# Altium project RXTX42_ver.0.0.PrjPcb
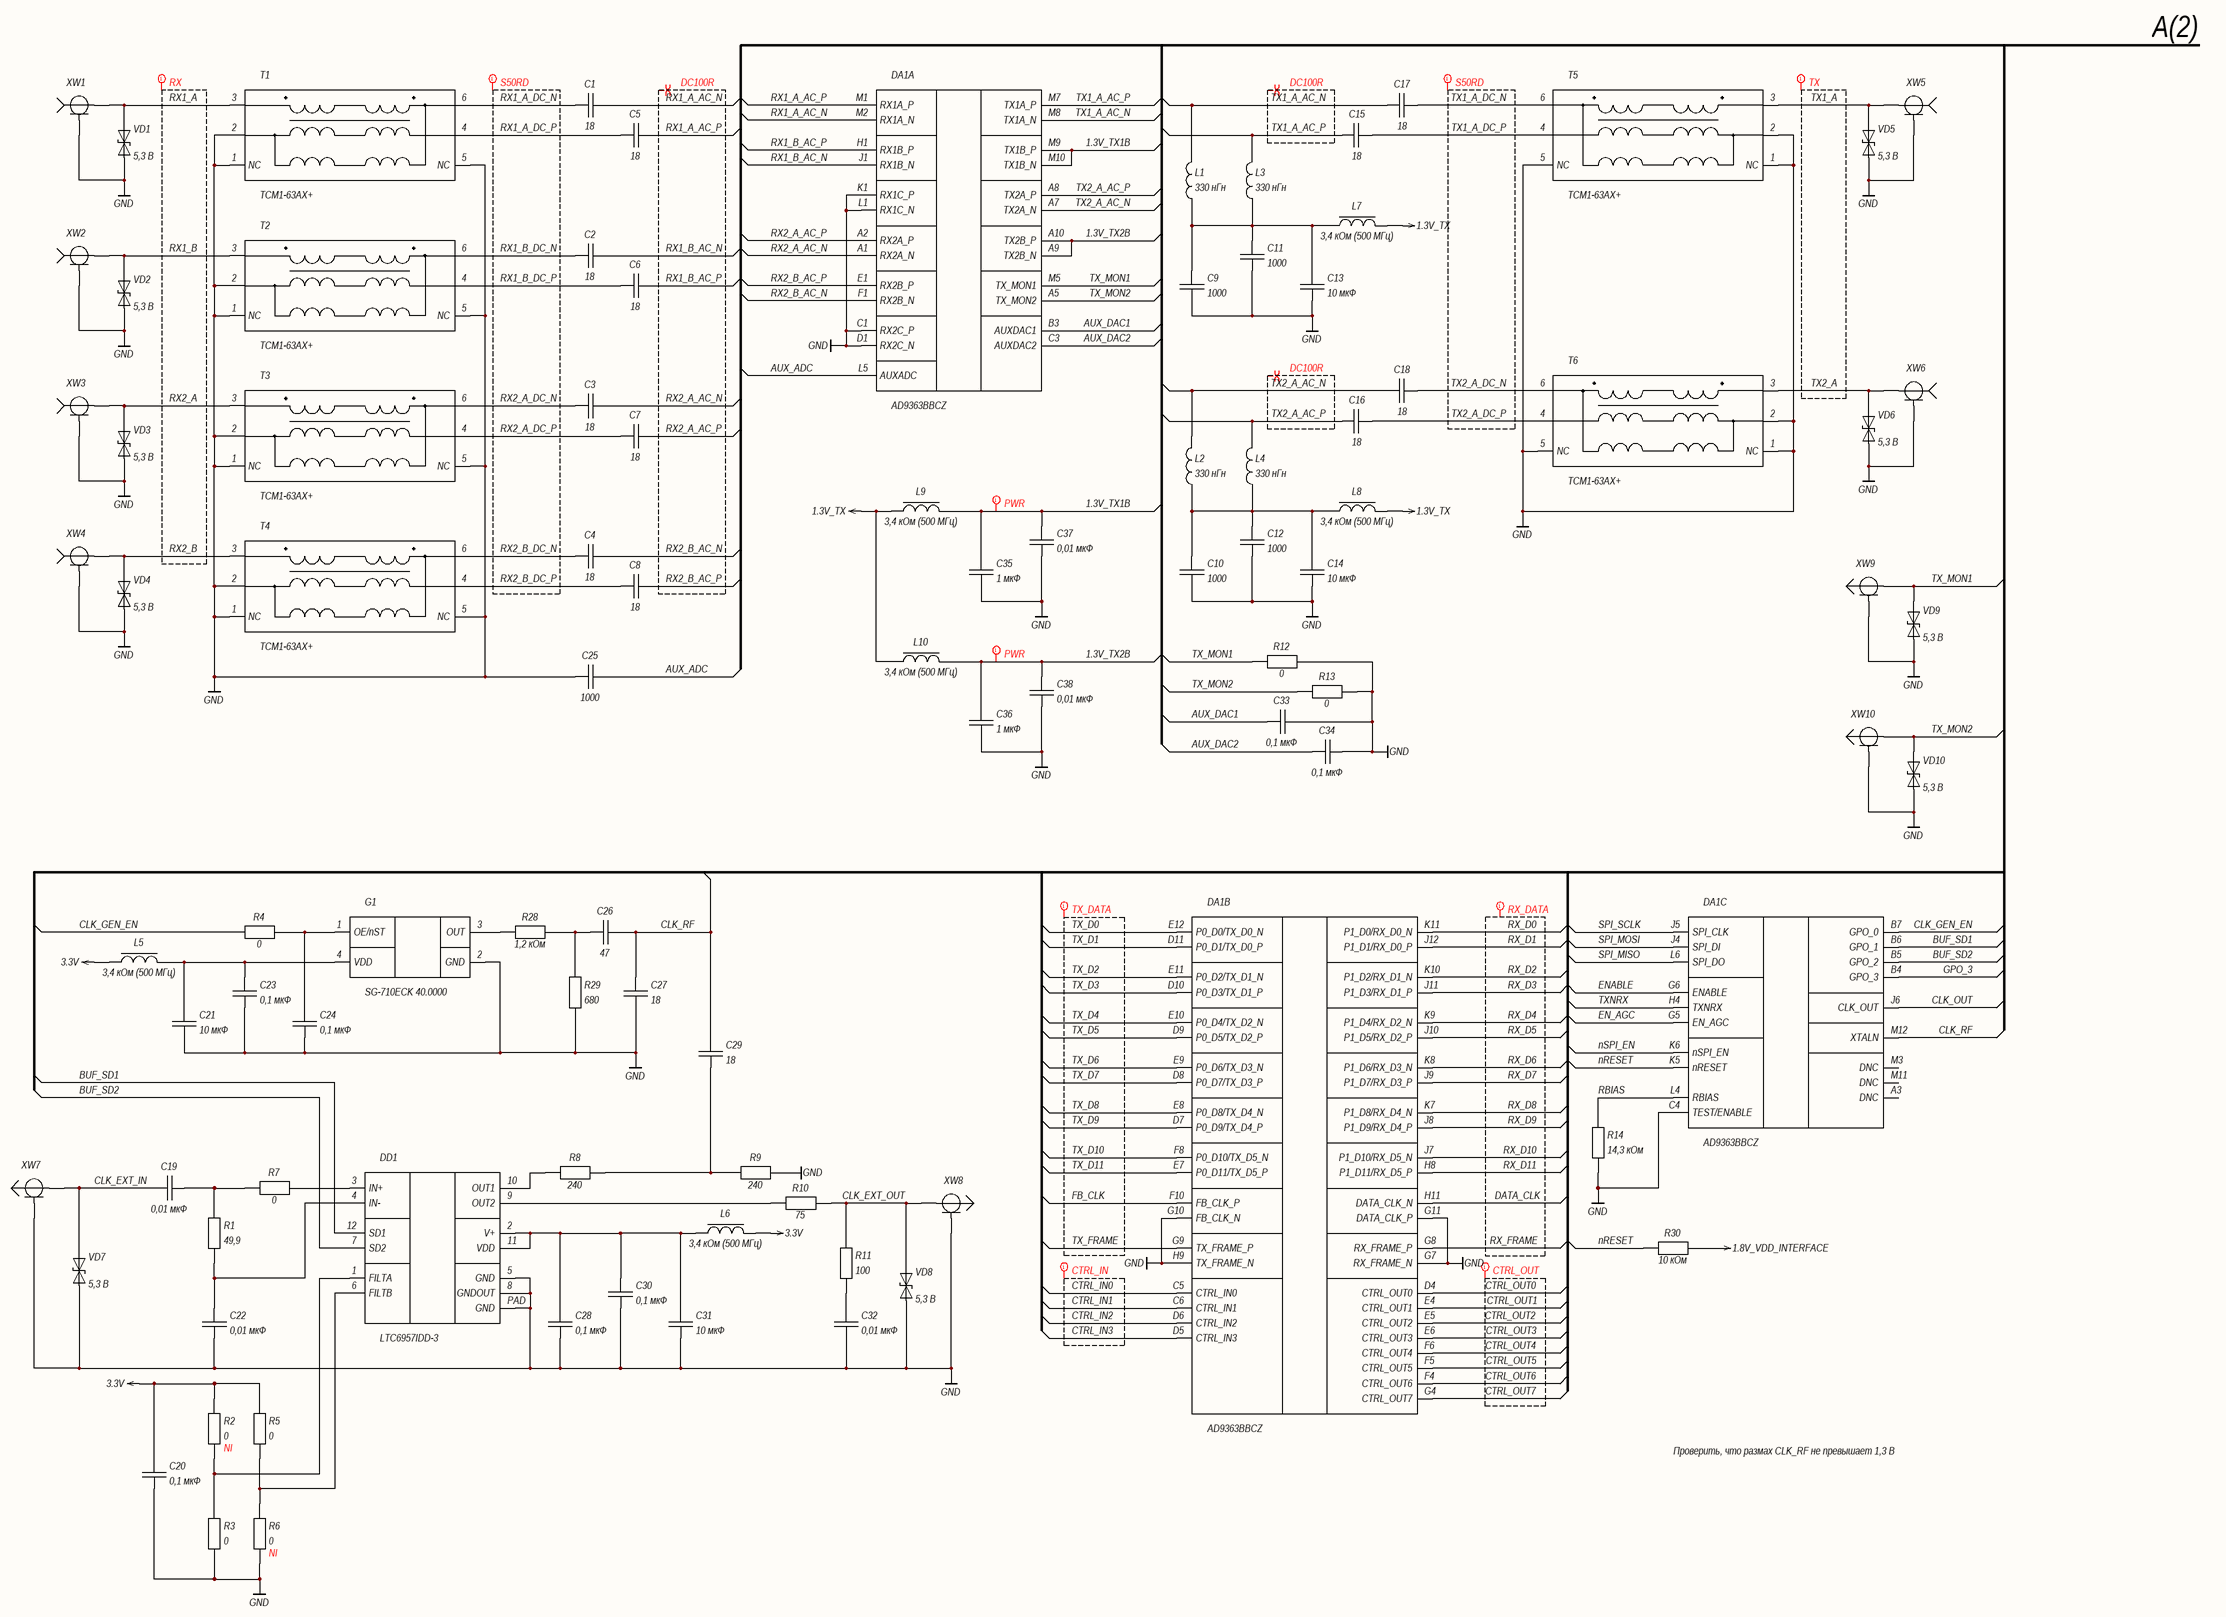
[diagram p0: Э3-1.SchDoc]
2 sheets, 189 parts. Net scope: global (net labels, ports and power ports of the same name join across sheets).
Board file: RXTX42_ver.0.0.PcbDoc
Sheets:
  Э3-1.SchDoc
  Э3-2.SchDoc

## Sheet Э3-1.SchDoc
size 840 x 594 mm; Address1: Address1; Address2: Address2; Address3: Address3; Address4: Address4; DocumentNumber: АБВГ.123456.001 Э3; SheetNumber: 1; SheetTotal: 2; Scale: 1:1; DocumentType: Схема электрическая принципиальная; FirstReferrence: АБВГ.123456.001

### Parts
C1  value 18  [C0201-B-0.3mm-NO]
C2  value 18  [C0201-B-0.3mm-NO]
C3  value 18  [C0201-B-0.3mm-NO]
C4  value 18  [C0201-B-0.3mm-NO]
C5  value 18  [C0201-B-0.3mm-NO]
C6  value 18  [C0201-B-0.3mm-NO]
C7  value 18  [C0201-B-0.3mm-NO]
C8  value 18  [C0201-B-0.3mm-NO]
C9  value 1000  [C0201-B-0.3mm-NO]
C10  value 1000  [C0201-B-0.3mm-NO]
C11  value 1000  [C0201-B-0.3mm-NO]
C12  value 1000  [C0201-B-0.3mm-NO]
C13  value 10 мкФ  [C0603-B-0.8mm-NO]
C14  value 10 мкФ  [C0603-B-0.8mm-NO]
C15  value 18  [C0201-B-0.3mm-NO]
C16  value 18  [C0201-B-0.3mm-NO]
C17  value 18  [C0201-B-0.3mm-NO]
C18  value 18  [C0201-B-0.3mm-NO]
C19  value 0,01 мкФ  [C0201-B-0.3mm-NO]
C20  value 0,1 мкФ  [C0402-B-0.5mm-NO]
C21  value 10 мкФ  [C0603-B-0.8mm-NO]
C22  value 0,01 мкФ  [C0201-B-0.3mm-NO]
C23  value 0,1 мкФ  [C0402-B-0.5mm-NO]
C24  value 0,1 мкФ  [C0402-B-0.5mm-NO]
C25  value 1000  [C0201-B-0.3mm-NO]
C26  value 47  [C0402-B-0.5mm-NO]
C27  value 18  [C0201-B-0.3mm-NO]
C28  value 0,1 мкФ  [C0402-B-0.5mm-NO]
C29  value 18  [C0201-B-0.3mm-NO]
C30  value 0,1 мкФ  [C0402-B-0.5mm-NO]
C31  value 10 мкФ  [C0603-B-0.8mm-NO]
C32  value 0,01 мкФ  [C0201-B-0.3mm-NO]
C33  value 0,1 мкФ  [C0201-B-0.3mm-NO]
C34  value 0,1 мкФ  [C0201-B-0.3mm-NO]
C35  value 1 мкФ  [C0402-B-0.5mm-NO]
C36  value 1 мкФ  [C0402-B-0.5mm-NO]
C37  value 0,01 мкФ  [C0201-B-0.3mm-NO]
C38  value 0,01 мкФ  [C0201-B-0.3mm-NO]
DA1  AD9363BBCZ  [144-BGA]  (value not drawn)  (parts A,B,C of 4)
DD1  LTC6957IDD-3  [12-DFN]
G1  SG-710ECK 40.0000  [Generator 7x5x1.3]
L1  value 330 нГн  [LCL0805-C-1.2mm-NO]
L2  value 330 нГн  [LCL0805-C-1.2mm-NO]
L3  value 330 нГн  [LCL0805-C-1.2mm-NO]
L4  value 330 нГн  [LCL0805-C-1.2mm-NO]
L5  value 3,4 кОм (500 МГц)  [L0402-B-0.5mm]
L6  value 3,4 кОм (500 МГц)  [L0402-B-0.5mm]
L7  value 3,4 кОм (500 МГц)  [L0402-B-0.5mm-NO]
L8  value 3,4 кОм (500 МГц)  [L0402-B-0.5mm-NO]
L9  value 3,4 кОм (500 МГц)  [L0402-B-0.5mm-NO]
L10  value 3,4 кОм (500 МГц)  [L0402-B-0.5mm-NO]
R1  value 49,9  [CR0402-B-0.35mm-NO]
R2  value 0  ComponentType: NI  [CR0402-B-0.35mm-NO]
R3  value 0  [CR0402-B-0.35mm-NO]
R4  value 0  [CR0402-B-0.35mm-NO]
R5  value 0  [CR0402-B-0.35mm-NO]
R6  value 0  ComponentType: NI  [CR0402-B-0.35mm-NO]
R7  value 0  [CR0402-B-0.35mm-NO]
R8  value 240  [CR0402-B-0.35mm-NO]
R9  value 240  [CR0402-B-0.35mm-NO]
R10  value 75  [CR0402-B-0.35mm-NO]
R11  value 100  [CR0402-B-0.35mm-NO]
R12  value 0  [CR0402-B-0.35mm-NO]
R13  value 0  [CR0402-B-0.35mm-NO]
R14  value 14,3 кОм  [CR0402-B-0.35mm-NO]
R28  value 1,2 кОм  [CR0402-B-0.35mm-NO]
R29  value 680  [CR0402-B-0.35mm-NO]
R30  value 10 кОм  [CR0402-B-0.35mm-NO]
T1  TCM1-63AX+  [TCM1-63AX+]
T2  TCM1-63AX+  [TCM1-63AX+]
T3  TCM1-63AX+  [TCM1-63AX+]
T4  TCM1-63AX+  [TCM1-63AX+]
T5  TCM1-63AX+  [TCM1-63AX+]
T6  TCM1-63AX+  [TCM1-63AX+]
VD1  Voltage: 5,3 В  [X3DFN2-NO]
VD2  Voltage: 5,3 В  [X3DFN2-NO]
VD3  Voltage: 5,3 В  [X3DFN2-NO]
VD4  Voltage: 5,3 В  [X3DFN2-NO]
VD5  Voltage: 5,3 В  [X3DFN2-NO]
VD6  Voltage: 5,3 В  [X3DFN2-NO]
VD7  Voltage: 5,3 В  [X3DFN2-NO]
VD8  Voltage: 5,3 В  [X3DFN2-NO]
VD9  Voltage: 5,3 В  [X3DFN2-NO]
VD10  Voltage: 5,3 В  [X3DFN2-NO]
XW1  XW(S)  [SMA-J-P-H-ST-EM1]  (value not drawn)
XW2  XW(S)  [SMA-J-P-H-ST-EM1]  (value not drawn)
XW3  XW(S)  [SMA-J-P-H-ST-EM1]  (value not drawn)
XW4  XW(S)  [SMA-J-P-H-ST-EM1]  (value not drawn)
XW5  XW(S)  [SMA-J-P-H-ST-EM1]  (value not drawn)
XW6  XW(S)  [SMA-J-P-H-ST-EM1]  (value not drawn)
XW7  XW(P)  [U.FL STR PLG]  (value not drawn)
XW8  XW(P)  [U.FL STR PLG]  (value not drawn)
XW9  XW(P)  [U.FL STR PLG]  (value not drawn)
XW10  XW(P)  [U.FL STR PLG]  (value not drawn)

### Nets
1.3V_TX: L7.2 L8.2 L9.1 L10.1
1.8V_VDD_INTERFACE: R30.2
3.3V: C20.1 L5.1 L6.2 R2.1 R5.1
GND: C9.2 C10.2 C11.2 C12.2 C13.2 C14.2 C20.2 C21.2 C22.2 C23.2 C24.2 C25.1 C27.2 C28.2 C30.2 C31.2 C32.2 C33.2 C34.2 C35.2 C36.2 C37.2 C38.2 DA1.C1(RX2C_P) DA1.C4(TEST/ENABLE) DA1.D1(RX2C_N) DA1.G7(RX_FRAME_N) DA1.G10(FB_CLK_N) DA1.G11(DATA_CLK_P) DA1.H9(TX_FRAME_N) DA1.K1(RX1C_P) DA1.L1(RX1C_N) DD1.5(GND) DD1.8(GNDOUT) DD1.PAD(GND) G1.2(GND) R3.2 R6.2 R9.2 R12.2 R13.2 R14.2 R29.2 T1.1(NC) T1.2 T1.5(NC) T2.1(NC) T2.2 T2.5(NC) T3.1(NC) T3.2 T3.5(NC) T4.1(NC) T4.2 T4.5(NC) T5.1(NC) T5.2 T5.5(NC) T6.1(NC) T6.2 T6.5(NC) VD1.2 VD2.2 VD3.2 VD4.2 VD5.2 VD6.2 VD7.2 VD8.2 VD9.2 VD10.2 XW1.2 XW2.2 XW3.2 XW4.2 XW5.2 XW6.2 XW7.2 XW8.2 XW9.2 XW10.2
1.3V_TX1B: C35.1 C37.1 DA1.M9(TX1B_P) DA1.M10(TX1B_N) L9.2
1.3V_TX2B: C36.1 C38.1 DA1.A9(TX2B_N) DA1.A10(TX2B_P) L10.2
AUX_ADC: C25.2 DA1.L5(AUXADC)
AUX_DAC1: C33.1 DA1.B3(AUXDAC1)
AUX_DAC2: C34.1 DA1.C3(AUXDAC2)
BUF_SD1: DA1.B6(GPO_1) DD1.12(SD1)
BUF_SD2: DA1.B5(GPO_2) DD1.7(SD2)
CLK_EXT_IN: C19.1 VD7.1 XW7.1
CLK_EXT_OUT: R10.2 R11.1 VD8.1 XW8.1
CLK_GEN_EN: DA1.B7(GPO_0) R4.1
CLK_OUT: DA1.J6(CLK_OUT)
CLK_RF: C26.2 C27.1 C29.1 DA1.M12(XTALN)
CTRL_IN0: DA1.C5(CTRL_IN0)
CTRL_IN1: DA1.C6(CTRL_IN1)
CTRL_IN2: DA1.D6(CTRL_IN2)
CTRL_IN3: DA1.D5(CTRL_IN3)
CTRL_OUT0: DA1.D4(CTRL_OUT0)
CTRL_OUT1: DA1.E4(CTRL_OUT1)
CTRL_OUT2: DA1.E5(CTRL_OUT2)
CTRL_OUT3: DA1.E6(CTRL_OUT3)
CTRL_OUT4: DA1.F6(CTRL_OUT4)
CTRL_OUT5: DA1.F5(CTRL_OUT5)
CTRL_OUT6: DA1.F4(CTRL_OUT6)
CTRL_OUT7: DA1.G4(CTRL_OUT7)
DATA_CLK: DA1.H11(DATA_CLK_N)
EN_AGC: DA1.G5(EN_AGC)
ENABLE: DA1.G6(ENABLE)
FB_CLK: DA1.F10(FB_CLK_P)
GPO_3: DA1.B4(GPO_3)
nRESET: DA1.K5(nRESET) R30.1
nSPI_EN: DA1.K6(nSPI_EN)
RBIAS: DA1.L4(RBIAS) R14.1
RX1_A: T1.3 VD1.1 XW1.1
RX1_A_AC_N: C1.2 DA1.M2(RX1A_N)
RX1_A_AC_P: C5.2 DA1.M1(RX1A_P)
RX1_A_DC_N: C1.1 T1.6
RX1_A_DC_P: C5.1 T1.4
RX1_B: T2.3 VD2.1 XW2.1
RX1_B_AC_N: C2.2 DA1.J1(RX1B_N)
RX1_B_AC_P: C6.2 DA1.H1(RX1B_P)
RX1_B_DC_N: C2.1 T2.6
RX1_B_DC_P: C6.1 T2.4
RX2_A: T3.3 VD3.1 XW3.1
RX2_A_AC_N: C3.2 DA1.A1(RX2A_N)
RX2_A_AC_P: C7.2 DA1.A2(RX2A_P)
RX2_A_DC_N: C3.1 T3.6
RX2_A_DC_P: C7.1 T3.4
RX2_B: T4.3 VD4.1 XW4.1
RX2_B_AC_N: C4.2 DA1.F1(RX2B_N)
RX2_B_AC_P: C8.2 DA1.E1(RX2B_P)
RX2_B_DC_N: C4.1 T4.6
RX2_B_DC_P: C8.1 T4.4
RX_D0: DA1.K11(P1_D0/RX_D0_N)
RX_D1: DA1.J12(P1_D1/RX_D0_P)
RX_D2: DA1.K10(P1_D2/RX_D1_N)
RX_D3: DA1.J11(P1_D3/RX_D1_P)
RX_D4: DA1.K9(P1_D4/RX_D2_N)
RX_D5: DA1.J10(P1_D5/RX_D2_P)
RX_D6: DA1.K8(P1_D6/RX_D3_N)
RX_D7: DA1.J9(P1_D7/RX_D3_P)
RX_D8: DA1.K7(P1_D8/RX_D4_N)
RX_D9: DA1.J8(P1_D9/RX_D4_P)
RX_D10: DA1.J7(P1_D10/RX_D5_N)
RX_D11: DA1.H8(P1_D11/RX_D5_P)
RX_FRAME: DA1.G8(RX_FRAME_P)
SPI_MISO: DA1.L6(SPI_DO)
SPI_MOSI: DA1.J4(SPI_DI)
SPI_SCLK: DA1.J5(SPI_CLK)
TX1_A: T5.3 VD5.1 XW5.1
TX1_A_AC_N: C17.2 DA1.M8(TX1A_N) L1.1
TX1_A_AC_P: C15.2 DA1.M7(TX1A_P) L3.1
TX1_A_DC_N: C17.1 T5.6
TX1_A_DC_P: C15.1 T5.4
TX2_A: T6.3 VD6.1 XW6.1
TX2_A_AC_N: C18.2 DA1.A7(TX2A_N) L2.1
TX2_A_AC_P: C16.2 DA1.A8(TX2A_P) L4.1
TX2_A_DC_N: C18.1 T6.6
TX2_A_DC_P: C16.1 T6.4
TX_D0: DA1.E12(P0_D0/TX_D0_N)
TX_D1: DA1.D11(P0_D1/TX_D0_P)
TX_D2: DA1.E11(P0_D2/TX_D1_N)
TX_D3: DA1.D10(P0_D3/TX_D1_P)
TX_D4: DA1.E10(P0_D4/TX_D2_N)
TX_D5: DA1.D9(P0_D5/TX_D2_P)
TX_D6: DA1.E9(P0_D6/TX_D3_N)
TX_D7: DA1.D8(P0_D7/TX_D3_P)
TX_D8: DA1.E8(P0_D8/TX_D4_N)
TX_D9: DA1.D7(P0_D9/TX_D4_P)
TX_D10: DA1.F8(P0_D10/TX_D5_N)
TX_D11: DA1.E7(P0_D11/TX_D5_P)
TX_FRAME: DA1.G9(TX_FRAME_P)
TX_MON1: DA1.M5(TX_MON1) R12.1 VD9.1 XW9.1
TX_MON2: DA1.A5(TX_MON2) R13.1 VD10.1 XW10.1
TXNRX: DA1.H4(TXNRX)
NetC9_1: C9.1 C11.1 C13.1 L1.2 L3.2 L7.1
NetC10_1: C10.1 C12.1 C14.1 L2.2 L4.2 L8.1
NetC19_2: C19.2 R1.1 R7.1
NetC21_1: C21.1 C23.1 G1.4(VDD) L5.2
NetC22_1: C22.1 DD1.4(IN-) R1.2
NetC24_1: C24.1 G1.1(OE/nST) R4.2
NetC26_1: C26.1 R28.2 R29.1
NetC28_1: C28.1 C30.1 C31.1 DD1.2(V+) DD1.11(VDD) L6.1
NetC29_2: C29.2 R8.2 R9.1
NetC32_1: C32.1 R11.2
NetDD1_1: DD1.1(FILTA) R2.2 R3.1
NetDD1_3: DD1.3(IN+) R7.2
NetDD1_6: DD1.6(FILTB) R5.2 R6.1
NetDD1_9: DD1.9(OUT2) R10.1
NetDD1_10: DD1.10(OUT1) R8.1
NetG1_3: G1.3(OUT) R28.1

Not connected (* = marked no-connect by the designer): DA1 A3(DNC) M3(DNC) M11(DNC)

### Layout directives
differential pair; differential pair class DC100R: RX1_A_AC_N, RX1_A_AC_P, RX1_B_AC_N, RX1_B_AC_P, RX2_A_AC_N, RX2_A_AC_P, RX2_B_AC_N, RX2_B_AC_P, TX1_A_AC_N, TX1_A_AC_P, TX2_A_AC_N, TX2_A_AC_P
net class TX_DATA: FB_CLK, TX_D0, TX_D1, TX_D2, TX_D3, TX_D4, TX_D5, TX_D6, TX_D7, TX_D8, TX_D9, TX_D10, TX_D11, TX_FRAME
net class CTRL_IN: CTRL_IN0, CTRL_IN1, CTRL_IN2, CTRL_IN3
net class CTRL_OUT: CTRL_OUT0, CTRL_OUT1, CTRL_OUT2, CTRL_OUT3, CTRL_OUT4, CTRL_OUT5, CTRL_OUT6, CTRL_OUT7
net class RX_DATA: DATA_CLK, RX_D0, RX_D1, RX_D2, RX_D3, RX_D4, RX_D5, RX_D6, RX_D7, RX_D8, RX_D9, RX_D10, RX_D11, RX_FRAME
net class PWR: 1.3V_TX1B, 1.3V_TX2B
net class RX: RX1_A, RX1_B, RX2_A, RX2_B
net class TX: TX1_A, TX2_A
net class S50RD: RX1_A_DC_N, RX1_A_DC_P, RX1_B_DC_N, RX1_B_DC_P, RX2_A_DC_N, RX2_A_DC_P, RX2_B_DC_N, RX2_B_DC_P, TX1_A_DC_N, TX1_A_DC_P, TX2_A_DC_N, TX2_A_DC_P

### Notes on the sheet
- A(2)
- Проверить, что размах CLK_RF не превышает 1,3 В
- Перв. примен.
- Справ. №
- Подп. и дата
- Инв. № дубл.
- Взам. инв. №
- Разраб.
- Изм.
- Лист
- № докум.
- Подп.
- Дата
- Лит.
- Масса
- Масштаб
- Пров.
- Т.контр.
- Листов
- Инв. № подл.
- Утв.
- Н.контр.
- 2.106-A1
- Копировал
- Формат А1

### Library data of the parts
C1-C8 C15-C18 = Non Polar Hor.: 0201 18 пФ ±5% 50 В C0G; PartNumber: GRM0335C1H180JA01D; TemperatureRange: -XX...+XX°C; Manufacturer: *; Package: *; HelpURL: *; Tolerance: *; TypeDielectric: *; ESR: *; ComponentType: CAP; VoltageRating: *
C9-C12 = Non Polar Ver.: 0201 1000 пФ ±10% 16 В X7R; TemperatureRange: -XX...+XX°C; Manufacturer: *; PartNumber: *; Package: *; HelpURL: *; Tolerance: *; TypeDielectric: *; ESR: *; ComponentType: CAP; VoltageRating: *
C13 C14 C21 C31 = Non Polar Ver.: 0603 10 мкФ ±10% 16 В X7R; TemperatureRange: -XX...+XX°C; Manufacturer: *; PartNumber: *; Package: *; HelpURL: *; Tolerance: *; TypeDielectric: *; ESR: *; ComponentType: CAP; VoltageRating: *
C19 = Non Polar Hor.: 0201 0,01 мкФ ±10% 16 В X7R; PartNumber: GRM0335C1H180JA01D; TemperatureRange: -XX...+XX°C; Manufacturer: *; Package: *; HelpURL: *; Tolerance: *; TypeDielectric: *; ESR: *; ComponentType: CAP; VoltageRating: *
C20 C23 C24 C28 C30 = Non Polar Ver.: 0402 0,1 мкФ ±10% 16 В X7R; TemperatureRange: -XX...+XX°C; Manufacturer: *; PartNumber: *; Package: *; HelpURL: *; Tolerance: *; TypeDielectric: *; ESR: *; ComponentType: CAP; VoltageRating: *
C22 C32 C37 C38 = Non Polar Ver.: 0201 0,01 мкФ ±10% 16 В X7R; TemperatureRange: -XX...+XX°C; Manufacturer: *; PartNumber: *; Package: *; HelpURL: *; Tolerance: *; TypeDielectric: *; ESR: *; ComponentType: CAP; VoltageRating: *
C25 = Non Polar Hor.: 0201 1000 пФ ±10% 16 В X7R; TemperatureRange: -XX...+XX°C; Manufacturer: *; PartNumber: *; Package: *; HelpURL: *; Tolerance: *; TypeDielectric: *; ESR: *; ComponentType: CAP; VoltageRating: *
C26 = Non Polar Hor.: 0402 47 пФ ±5% 50 В X7R; PartNumber: GRM0335C1H180JA01D; TemperatureRange: -XX...+XX°C; Manufacturer: *; Package: *; HelpURL: *; Tolerance: *; TypeDielectric: *; ESR: *; ComponentType: CAP; VoltageRating: *
C27 C29 = Non Polar Ver.: 0201 18 пФ ±5% 50 В C0G; TemperatureRange: -XX...+XX°C; Manufacturer: *; PartNumber: *; Package: *; HelpURL: *; Tolerance: *; TypeDielectric: *; ESR: *; ComponentType: CAP; VoltageRating: *
C33 C34 = Non Polar Hor.: 0201 0,1 мкФ ±10% 16 В X7R; TemperatureRange: -XX...+XX°C; Manufacturer: *; PartNumber: *; Package: *; HelpURL: *; Tolerance: *; TypeDielectric: *; ESR: *; ComponentType: CAP; VoltageRating: *
C35 C36 = Non Polar Ver.: 0402 1 мкФ ±10% 16 В X7R; TemperatureRange: -XX...+XX°C; Manufacturer: *; PartNumber: *; Package: *; HelpURL: *; Tolerance: *; TypeDielectric: *; ESR: *; ComponentType: CAP; VoltageRating: *
DA1 = AD9363: RF Agile Transceiver; Manufacturer: AnalogDevices; TemperatureRange: -40...+85°C; Package: *; PartNumber: AD9363BBCZ; ComponentType: RF; DatasheetURL: *; HelpURL: *; PinCount: 144
DD1 = LTC6957IDD-3: Ultra-Small, Low-Power, I2C-Compatible, 860-SPS, 16-Bit ADCs With Internal Reference, Oscillator, and Programmable Comparator; Manufacturer: AnalogDevices; TemperatureRange: -40...+85°C; Package: 12-DFN; DatasheetURL: *; HelpURL: *; PinCount: 12; PartNumber: LTC6957IDD-3; ComponentType: IC
G1 = Generator: TemperatureRange: -...+°C; Tolerance: ± ppm; PartNumber: SG-710ECK 40.0000; Manufacturer: *; HelpURL: *; ComponentType: GEN; DatasheetURL: *; Package: *; PinCount: 4; Frequency: *; LoadCapacitance: *
L1-L4 = Inductor Ver.: PartNumber: L-15WR33GV4E; TemperatureRange: -XX...+XX°C; Manufacturer: *; Package: *; HelpURL: *; MaxCurrent: *; ComponentType: IND; DatasheetURL: *; PinCount: 2
L5-L10 = Inductor MC Hor.: PartNumber: BLM15HD182BH1; TemperatureRange: -XX...+XX°C; Manufacturer: *; Package: *; HelpURL: *; MaxCurrent: *; ComponentType: IND; DatasheetURL: *; PinCount: 2
R1 = Resistor Ver.: 0402 49,9 Ом 1%; TemperatureRange: -XX...+XX°C; Manufacturer: *; PartNumber: *; Package: *; HelpURL: *; PowerRating: *; DatasheetURL: *; Tolerance: *; ComponentType: RES
R2 R3 R5 R6 = Resistor Ver.: 0402 0 Ом; TemperatureRange: -XX...+XX°C; Manufacturer: *; PartNumber: *; Package: *; HelpURL: *; PowerRating: *; DatasheetURL: *; Tolerance: *
  R3 R5: ComponentType: RES
R4 R7 R12 R13 = Resistor Hor.: 0402 0 Ом; TemperatureRange: -XX...+XX°C; Manufacturer: *; PartNumber: *; Package: *; HelpURL: *; PowerRating: *; Tolerance: *; DatasheetURL: *; ComponentType: RES
R8 R9 = Resistor Hor.: 0402 240 Ом ±1%; TemperatureRange: -XX...+XX°C; Manufacturer: *; PartNumber: *; Package: *; HelpURL: *; PowerRating: *; Tolerance: *; DatasheetURL: *; ComponentType: RES
R10 = Resistor Hor.: 0402 75 Ом ±1%; TemperatureRange: -XX...+XX°C; Manufacturer: *; PartNumber: *; Package: *; HelpURL: *; PowerRating: *; Tolerance: *; DatasheetURL: *; ComponentType: RES
R11 = Resistor Ver.: 0402 100 Ом ±1%; TemperatureRange: -XX...+XX°C; Manufacturer: *; PartNumber: *; Package: *; HelpURL: *; PowerRating: *; DatasheetURL: *; Tolerance: *; ComponentType: RES
R14 = Resistor Ver.: 0402 14,3 кОм ±1%; TemperatureRange: -XX...+XX°C; Manufacturer: *; PartNumber: *; Package: *; HelpURL: *; PowerRating: *; DatasheetURL: *; Tolerance: *; ComponentType: RES
R28 = Resistor Hor.: 0402 1,2 кОм ±1%; TemperatureRange: -XX...+XX°C; Manufacturer: *; PartNumber: *; Package: *; HelpURL: *; PowerRating: *; Tolerance: *; DatasheetURL: *; ComponentType: RES
R29 = Resistor Ver.: 0402 680 Ом ±1%; TemperatureRange: -XX...+XX°C; Manufacturer: *; PartNumber: *; Package: *; HelpURL: *; PowerRating: *; DatasheetURL: *; Tolerance: *; ComponentType: RES
R30 = Resistor Hor.: 0402 10 кОм ±5%; TemperatureRange: -XX...+XX°C; Manufacturer: *; PartNumber: *; Package: *; HelpURL: *; PowerRating: *; Tolerance: *; DatasheetURL: *; ComponentType: RES
T1-T6 = TCM1-63AX+: TemperatureRange: -40...+85°C; Manufacturer: *; Package: *; HelpURL: *; MaxCurrent: *; ComponentType: TR; DatasheetURL: *; PinCount: 6; PartNumber: TCM1-63AX+
VD1-VD10 = TVS Ver.: PartNumber: ESD8472MUT5G; ComponentType: TVS
XW1-XW6 = XW(S): TemperatureRange: -XX...+XX°C; Manufacturer: *; Package: *; HelpURL: *; DatasheetURL: *; PartNumber: *; PinCount: 2; ComponentType: Connector
XW7-XW10 = XW(P): TemperatureRange: -XX...+XX°C; Manufacturer: *; Package: *; HelpURL: *; DatasheetURL: *; PartNumber: *; PinCount: 2; ComponentType: Connector

## Sheet Э3-2.SchDoc
size 840 x 594 mm; Address1: Address1; Address2: Address2; Address3: Address3; Address4: Address4; DocumentNumber: АБВГ.123456.001 Э3; SheetNumber: 2; SheetTotal: 2; Scale: 1:1; DocumentType: Схема электрическая принципиальная; FirstReferrence: АБВГ.123456.001
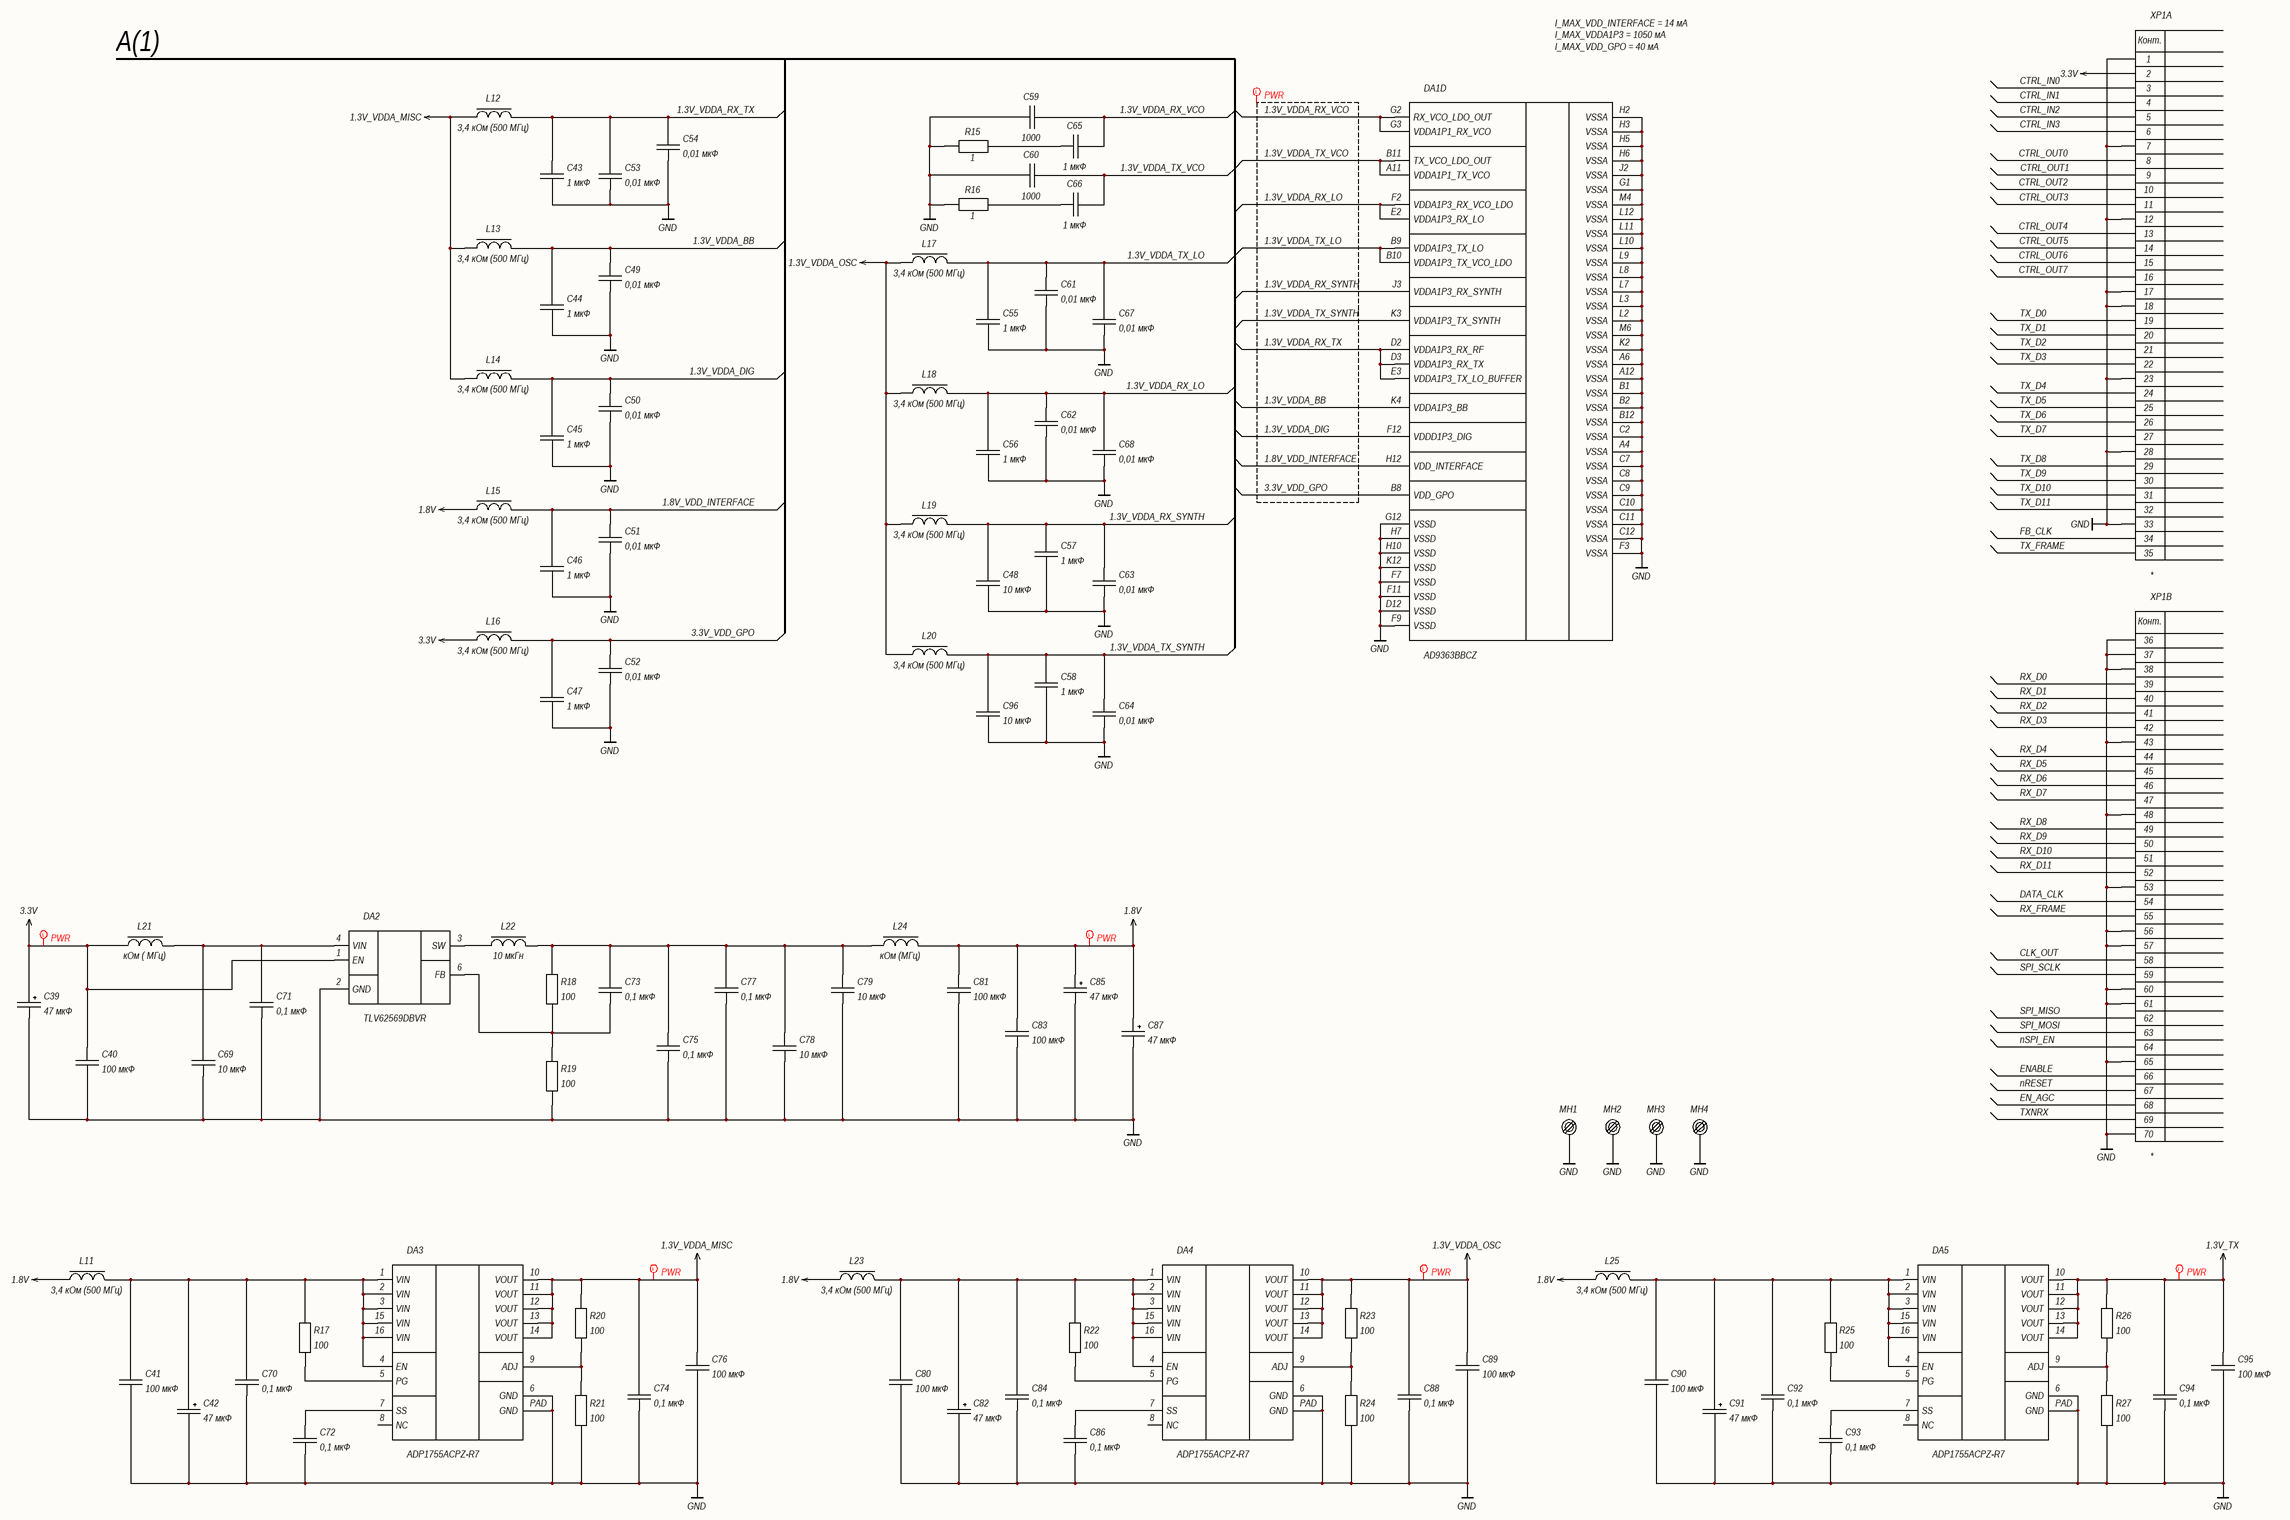
[diagram p1: Э3-2.SchDoc]

### Parts
C39  value 47 мкФ  [TL-A-B-1.8MM]
C40  value 100 мкФ  [C1206-B-1.6mm-NO]
C41  value 100 мкФ  [C1206-B-1.6mm]
C42  value 47 мкФ  [TL-A-B-1.8MM]
C43  value 1 мкФ  [C0402-B-0.5mm-NO]
C44  value 1 мкФ  [C0402-B-0.5mm-NO]
C45  value 1 мкФ  [C0402-B-0.5mm-NO]
C46  value 1 мкФ  [C0402-B-0.5mm-NO]
C47  value 1 мкФ  [C0402-B-0.5mm-NO]
C48  value 10 мкФ  [C0603-B-0.8mm-NO]
C49  value 0,01 мкФ  [C0201-B-0.3mm-NO]
C50  value 0,01 мкФ  [C0201-B-0.3mm-NO]
C51  value 0,01 мкФ  [C0201-B-0.3mm-NO]
C52  value 0,01 мкФ  [C0201-B-0.3mm-NO]
C53  value 0,01 мкФ  [C0201-B-0.3mm-NO]
C54  value 0,01 мкФ  [C0201-B-0.3mm-NO]
C55  value 1 мкФ  [C0402-B-0.5mm-NO]
C56  value 1 мкФ  [C0402-B-0.5mm-NO]
C57  value 1 мкФ  [C0402-B-0.5mm-NO]
C58  value 1 мкФ  [C0402-B-0.5mm-NO]
C59  value 1000  [C0201-B-0.3mm-NO]
C60  value 1000  [C0201-B-0.3mm-NO]
C61  value 0,01 мкФ  [C0201-B-0.3mm-NO]
C62  value 0,01 мкФ  [C0201-B-0.3mm-NO]
C63  value 0,01 мкФ  [C0201-B-0.3mm-NO]
C64  value 0,01 мкФ  [C0201-B-0.3mm-NO]
C65  value 1 мкФ  [C0402-B-0.5mm-NO]
C66  value 1 мкФ  [C0402-B-0.5mm-NO]
C67  value 0,01 мкФ  [C0201-B-0.3mm-NO]
C68  value 0,01 мкФ  [C0201-B-0.3mm-NO]
C69  value 10 мкФ  [C0603-B-0.8mm-NO]
C70  value 0,1 мкФ  [C0402-B-0.5mm-NO]
C71  value 0,1 мкФ  [C0402-B-0.5mm-NO]
C72  value 0,1 мкФ  [C0402-B-0.5mm-NO]
C73  value 0,1 мкФ  [C0402-B-0.5mm-NO]
C74  value 0,1 мкФ  [C0402-B-0.5mm-NO]
C75  value 0,1 мкФ  [C0402-B-0.5mm-NO]
C76  value 100 мкФ  [C1206-B-1.6mm]
C77  value 0,1 мкФ  [C0402-B-0.5mm-NO]
C78  value 10 мкФ  [C0603-B-0.8mm-NO]
C79  value 10 мкФ  [C0603-B-0.8mm-NO]
C80  value 100 мкФ  [C1206-B-1.6mm]
C81  value 100 мкФ  [C1206-B-1.6mm-NO]
C82  value 47 мкФ  [TL-A-B-1.8MM]
C83  value 100 мкФ  [C1206-B-1.6mm-NO]
C84  value 0,1 мкФ  [C0402-B-0.5mm-NO]
C85  value 47 мкФ  [TL-A-B-1.8MM]
C86  value 0,1 мкФ  [C0402-B-0.5mm-NO]
C87  value 47 мкФ  [TL-A-B-1.8MM]
C88  value 0,1 мкФ  [C0402-B-0.5mm-NO]
C89  value 100 мкФ  [C1206-B-1.6mm]
C90  value 100 мкФ  [C1206-B-1.6mm]
C91  value 47 мкФ  [TL-A-B-1.8MM]
C92  value 0,1 мкФ  [C0402-B-0.5mm-NO]
C93  value 0,1 мкФ  [C0402-B-0.5mm-NO]
C94  value 0,1 мкФ  [C0402-B-0.5mm-NO]
C95  value 100 мкФ  [C1206-B-1.6mm]
C96  value 10 мкФ  [C0603-B-0.8mm-NO]
DA1  AD9363BBCZ  [144-BGA]  (value not drawn)  (part D of 4)
DA2  TLV62569DBVR  [SOT-23-5]
DA3  ADP1755ACPZ-R7  [16-LFCSP-4-H0.75]
DA4  ADP1755ACPZ-R7  [16-LFCSP-4-H0.75]
DA5  ADP1755ACPZ-R7  [16-LFCSP-4-H0.75]
L11  value 3,4 кОм (500 МГц)  [L0402-B-0.5mm]
L12  value 3,4 кОм (500 МГц)  [L0402-B-0.5mm-NO]
L13  value 3,4 кОм (500 МГц)  [L0402-B-0.5mm-NO]
L14  value 3,4 кОм (500 МГц)  [L0402-B-0.5mm-NO]
L15  value 3,4 кОм (500 МГц)  [L0402-B-0.5mm-NO]
L16  value 3,4 кОм (500 МГц)  [L0402-B-0.5mm-NO]
L17  value 3,4 кОм (500 МГц)  [L0402-B-0.5mm-NO]
L18  value 3,4 кОм (500 МГц)  [L0402-B-0.5mm-NO]
L19  value 3,4 кОм (500 МГц)  [L0402-B-0.5mm-NO]
L20  value 3,4 кОм (500 МГц)  [L0402-B-0.5mm-NO]
L21  value кОм ( МГц)  [L0805-B-0.9mm]
L22  value 10 мкГн  [IHLP-2525CZ-01]
L23  value 3,4 кОм (500 МГц)  [L0402-B-0.5mm]
L24  value кОм (МГц)  [L0805-B-0.9mm]
L25  value 3,4 кОм (500 МГц)  [L0402-B-0.5mm]
MH1  Mechanical Connection  [Отверстие 3,2х7]  (value not drawn)
MH2  Mechanical Connection  [Отверстие 3,2х7]  (value not drawn)
MH3  Mechanical Connection  [Отверстие 3,2х7]  (value not drawn)
MH4  Mechanical Connection  [Отверстие 3,2х7]  (value not drawn)
R15  value 1  [CR0402-B-0.35mm-NO]
R16  value 1  [CR0402-B-0.35mm-NO]
R17  value 100  [CR0402-B-0.35mm-NO]
R18  value 100  [CR0402-B-0.35mm-NO]
R19  value 100  [CR0402-B-0.35mm-NO]
R20  value 100  [CR0402-B-0.35mm]
R21  value 100  [CR0402-B-0.35mm]
R22  value 100  [CR0402-B-0.35mm-NO]
R23  value 100  [CR0402-B-0.35mm]
R24  value 100  [CR0402-B-0.35mm]
R25  value 100  [CR0402-B-0.35mm-NO]
R26  value 100  [CR0402-B-0.35mm]
R27  value 100  [CR0402-B-0.35mm]
XP1  *  [PLD1.27-70-NO]  (parts A,B of 2)

### Nets
1.3V_TX: C94.1 C95.1 DA5.10(VOUT) DA5.11(VOUT) DA5.12(VOUT) DA5.13(VOUT) DA5.14(VOUT) R26.1
1.3V_VDDA_MISC: C74.1 C76.1 DA3.10(VOUT) DA3.11(VOUT) DA3.12(VOUT) DA3.13(VOUT) DA3.14(VOUT) L12.1 L13.1 L14.1 R20.1
1.3V_VDDA_OSC: C88.1 C89.1 DA4.10(VOUT) DA4.11(VOUT) DA4.12(VOUT) DA4.13(VOUT) DA4.14(VOUT) L17.1 L18.1 L19.1 L20.1 R23.1
1.8V: C81.1 C83.1 C85.1 C87.1 L11.1 L15.1 L23.1 L24.2 L25.1
1.8V_VDD_INTERFACE: C46.1 C51.1 DA1.H12(VDD_INTERFACE) L15.2
3.3V: C39.1 C40.1 DA2.1(EN) L16.1 L21.1 XP1.2
GND: C39.2 C40.2 C41.2 C42.2 C43.2 C44.2 C45.2 C46.2 C47.2 C48.2 C49.2 C50.2 C51.2 C52.2 C53.2 C54.2 C55.2 C56.2 C57.2 C58.2 C59.1 C60.1 C61.2 C62.2 C63.2 C64.2 C67.2 C68.2 C69.2 C70.2 C71.2 C72.2 C74.2 C75.2 C76.2 C77.2 C78.2 C79.2 C80.2 C81.2 C82.2 C83.2 C84.2 C85.2 C86.2 C87.2 C88.2 C89.2 C90.2 C91.2 C92.2 C93.2 C94.2 C95.2 C96.2 DA1.A4(VSSA) DA1.A6(VSSA) DA1.A12(VSSA) DA1.B1(VSSA) DA1.B2(VSSA) DA1.B12(VSSA) DA1.C2(VSSA) DA1.C7(VSSA) DA1.C8(VSSA) DA1.C9(VSSA) DA1.C10(VSSA) DA1.C11(VSSA) DA1.C12(VSSA) DA1.D12(VSSD) DA1.F3(VSSA) DA1.F7(VSSD) DA1.F9(VSSD) DA1.F11(VSSD) DA1.G1(VSSA) DA1.G12(VSSD) DA1.H2(VSSA) DA1.H3(VSSA) DA1.H5(VSSA) DA1.H6(VSSA) DA1.H7(VSSD) DA1.H10(VSSD) DA1.J2(VSSA) DA1.K2(VSSA) DA1.K12(VSSD) DA1.L2(VSSA) DA1.L3(VSSA) DA1.L7(VSSA) DA1.L8(VSSA) DA1.L9(VSSA) DA1.L10(VSSA) DA1.L11(VSSA) DA1.L12(VSSA) DA1.M4(VSSA) DA1.M6(VSSA) DA2.2(GND) DA3.6(GND) DA3.PAD(GND) DA4.6(GND) DA4.PAD(GND) DA5.6(GND) DA5.PAD(GND) MH1.0 MH2.0 MH3.0 MH4.0 R15.1 R16.1 R19.2 R21.2 R24.2 R27.2 XP1.1 XP1.7 XP1.12 XP1.17 XP1.18 XP1.23 XP1.28 XP1.33 XP1.36 XP1.37 XP1.38 XP1.43 XP1.48 XP1.53 XP1.56 XP1.57 XP1.60 XP1.61 XP1.65 XP1.70
1.3V_VDDA_BB: C44.1 C49.1 DA1.K4(VDDA1P3_BB) L13.2
1.3V_VDDA_DIG: C45.1 C50.1 DA1.F12(VDDD1P3_DIG) L14.2
1.3V_VDDA_RX_LO: C56.1 C62.1 C68.1 DA1.E2(VDDA1P3_RX_LO) DA1.F2(VDDA1P3_RX_VCO_LDO) L18.2
1.3V_VDDA_RX_SYNTH: C48.1 C57.1 C63.1 DA1.J3(VDDA1P3_RX_SYNTH) L19.2
1.3V_VDDA_RX_TX: C43.1 C53.1 C54.1 DA1.D2(VDDA1P3_RX_RF) DA1.D3(VDDA1P3_RX_TX) DA1.E3(VDDA1P3_TX_LO_BUFFER) L12.2
1.3V_VDDA_RX_VCO: C59.2 C65.2 DA1.G2(RX_VCO_LDO_OUT) DA1.G3(VDDA1P1_RX_VCO)
1.3V_VDDA_TX_LO: C55.1 C61.1 C67.1 DA1.B9(VDDA1P3_TX_LO) DA1.B10(VDDA1P3_TX_VCO_LDO) L17.2
1.3V_VDDA_TX_SYNTH: C58.1 C64.1 C96.1 DA1.K3(VDDA1P3_TX_SYNTH) L20.2
1.3V_VDDA_TX_VCO: C60.2 C66.2 DA1.A11(VDDA1P1_TX_VCO) DA1.B11(TX_VCO_LDO_OUT)
3.3V_VDD_GPO: C47.1 C52.1 DA1.B8(VDD_GPO) L16.2
CLK_OUT: XP1.58
CTRL_IN0: XP1.3
CTRL_IN1: XP1.4
CTRL_IN2: XP1.5
CTRL_IN3: XP1.6
CTRL_OUT0: XP1.8
CTRL_OUT1: XP1.9
CTRL_OUT2: XP1.10
CTRL_OUT3: XP1.11
CTRL_OUT4: XP1.13
CTRL_OUT5: XP1.14
CTRL_OUT6: XP1.15
CTRL_OUT7: XP1.16
DATA_CLK: XP1.54
EN_AGC: XP1.68
ENABLE: XP1.66
FB_CLK: XP1.34
nRESET: XP1.67
nSPI_EN: XP1.64
RX_D0: XP1.39
RX_D1: XP1.40
RX_D2: XP1.41
RX_D3: XP1.42
RX_D4: XP1.44
RX_D5: XP1.45
RX_D6: XP1.46
RX_D7: XP1.47
RX_D8: XP1.49
RX_D9: XP1.50
RX_D10: XP1.51
RX_D11: XP1.52
RX_FRAME: XP1.55
SPI_MISO: XP1.62
SPI_MOSI: XP1.63
SPI_SCLK: XP1.59
TX_D0: XP1.19
TX_D1: XP1.20
TX_D2: XP1.21
TX_D3: XP1.22
TX_D4: XP1.24
TX_D5: XP1.25
TX_D6: XP1.26
TX_D7: XP1.27
TX_D8: XP1.29
TX_D9: XP1.30
TX_D10: XP1.31
TX_D11: XP1.32
TX_FRAME: XP1.35
TXNRX: XP1.69
NetC41_1: C41.1 C42.1 C70.1 DA3.1(VIN) DA3.2(VIN) DA3.3(VIN) DA3.4(EN) DA3.15(VIN) DA3.16(VIN) L11.2 R17.1
NetC65_1: C65.1 R15.2
NetC66_1: C66.1 R16.2
NetC69_1: C69.1 C71.1 DA2.4(VIN) L21.2
NetC72_1: C72.1 DA3.7(SS)
NetC73_1: C73.1 C75.1 C77.1 C78.1 C79.1 L22.2 L24.1 R18.1
NetC73_2: C73.2 DA2.6(FB) R18.2 R19.1
NetC80_1: C80.1 C82.1 C84.1 DA4.1(VIN) DA4.2(VIN) DA4.3(VIN) DA4.4(EN) DA4.15(VIN) DA4.16(VIN) L23.2 R22.1
NetC86_1: C86.1 DA4.7(SS)
NetC90_1: C90.1 C91.1 C92.1 DA5.1(VIN) DA5.2(VIN) DA5.3(VIN) DA5.4(EN) DA5.15(VIN) DA5.16(VIN) L25.2 R25.1
NetC93_1: C93.1 DA5.7(SS)
NetDA2_3: DA2.3(SW) L22.1
NetDA3_5: DA3.5(PG) R17.2
NetDA3_9: DA3.9(ADJ) R20.2 R21.1
NetDA4_5: DA4.5(PG) R22.2
NetDA4_9: DA4.9(ADJ) R23.2 R24.1
NetDA5_5: DA5.5(PG) R25.2
NetDA5_9: DA5.9(ADJ) R26.2 R27.1

Not connected (* = marked no-connect by the designer): DA3 8(NC); DA4 8(NC); DA5 8(NC)

### Layout directives
net class PWR: 1.3V_TX, 1.3V_VDDA_BB, 1.3V_VDDA_DIG, 1.3V_VDDA_MISC, 1.3V_VDDA_OSC, 1.3V_VDDA_RX_LO, 1.3V_VDDA_RX_SYNTH, 1.3V_VDDA_RX_TX, 1.3V_VDDA_RX_VCO, 1.3V_VDDA_TX_LO, 1.3V_VDDA_TX_SYNTH, 1.3V_VDDA_TX_VCO, 1.8V, 1.8V_VDD_INTERFACE, 3.3V, 3.3V_VDD_GPO

### Notes on the sheet
- A(1)
- (near DA1) I_MAX_VDD_INTERFACE = 14 мА
  I_MAX_VDDA1P3 = 1050 мА
  I_MAX_VDD_GPO = 40 мА
- Перв. примен.
- Справ. №
- Подп. и дата
- Инв. № дубл.
- Взам. инв. №
- Инв. № подл.
- Изм.
- Лист
- № докум.
- Подп.
- Дата
- 2.106-A2
- Копировал
- Формат А1
- (in symbol XP_70_Pin_Open, part A) Конт.
- (in symbol XP_70_Pin_Open, part B) Конт.

### Library data of the parts
C39 C42 C82 C85 C87 C91 = Polar Ver.: TemperatureRange: -XX...+XX°C; Manufacturer: *; PartNumber: *; Package: *; HelpURL: *; Tolerance: *; Impedance: *; ESR: *; ComponentType: CAP
C40 C41 C76 C80 C81 C83 C89 C90 C95 = Non Polar Ver.: 1206 100 мкФ ±20% 6,3 В X5R; TemperatureRange: -XX...+XX°C; Manufacturer: *; PartNumber: *; Package: *; HelpURL: *; Tolerance: *; TypeDielectric: *; ESR: *; ComponentType: CAP; VoltageRating: *
C43-C47 C55-C58 = Non Polar Ver.: as C35 on sheet Э3-1; Manufacturer: *; PartNumber: *; Package: *; HelpURL: *; Tolerance: *; TypeDielectric: *; ESR: *; ComponentType: CAP; VoltageRating: *
C48 C69 C78 C79 C96 = Non Polar Ver.: as C13 on sheet Э3-1; Manufacturer: *; PartNumber: *; Package: *; HelpURL: *; Tolerance: *; TypeDielectric: *; ESR: *; ComponentType: CAP; VoltageRating: *
C49-C54 C61-C64 C67 C68 = Non Polar Ver.: as C22 on sheet Э3-1; Manufacturer: *; PartNumber: *; Package: *; HelpURL: *; Tolerance: *; TypeDielectric: *; ESR: *; ComponentType: CAP; VoltageRating: *
C59 C60 = Non Polar Hor.: as C25 on sheet Э3-1; Manufacturer: *; PartNumber: *; Package: *; HelpURL: *; Tolerance: *; TypeDielectric: *; ESR: *; ComponentType: CAP; VoltageRating: *
C65 C66 = Non Polar Hor.: 0402 1 мкФ ±10% 16 В X7R; TemperatureRange: -XX...+XX°C; Manufacturer: *; PartNumber: *; Package: *; HelpURL: *; Tolerance: *; TypeDielectric: *; ESR: *; ComponentType: CAP; VoltageRating: *
C70-C75 C77 C84 C86 C88 C92-C94 = Non Polar Ver.: as C20 on sheet Э3-1; Manufacturer: *; PartNumber: *; Package: *; HelpURL: *; Tolerance: *; TypeDielectric: *; ESR: *; ComponentType: CAP; VoltageRating: *
DA1 = AD9363: as DA1 on sheet Э3-1; Package: *; PartNumber: AD9363BBCZ; ComponentType: RF; DatasheetURL: *; HelpURL: *; PinCount: 144
DA2 = TLV62569DBV: 2-A High Efficiency Synchronous Buck Converter in SOT Package; Manufacturer: Texas Instruments, Inc.; TemperatureRange: -40...+85°C; Package: SOT-23; PartNumber: TLV62569DBVR; ComponentType: IC; DatasheetURL: *; HelpURL: *; PinCount: 6
DA3-DA5 = ADP1755ACPZ-R7: 1.2 A, Ultralow Noise, / High PSRR, RF Linear Regulator; Manufacturer: Analog Devices, Inc.; TemperatureRange: -40...+125°C; Package: 16-LFCSP_WQ; PartNumber: ADP1755ACPZ-R7; ComponentType: IC; DatasheetURL: *; HelpURL: *; PinCount: 16
L11-L20 L23-L25 = Inductor MC Hor.: as L5 on sheet Э3-1; Manufacturer: *; Package: *; HelpURL: *; MaxCurrent: *; ComponentType: IND; DatasheetURL: *; PinCount: 2
L21 = Inductor MC Hor.: TemperatureRange: -XX...+XX°C; Manufacturer: *; Package: *; HelpURL: *; MaxCurrent: *; ComponentType: IND; DatasheetURL: *; PinCount: 2
L22 = Inductor MC Hor.: PartNumber: IHLP2525CZER100M01; TemperatureRange: -XX...+XX°C; Manufacturer: *; Package: *; HelpURL: *; MaxCurrent: *; ComponentType: IND; DatasheetURL: *; PinCount: 2
R15 R16 = Resistor Hor.: 0402 1 Ом ±1%; TemperatureRange: -XX...+XX°C; Manufacturer: *; PartNumber: *; Package: *; HelpURL: *; PowerRating: *; Tolerance: *; DatasheetURL: *; ComponentType: RES
R17-R27 = Resistor Ver.: as R11 on sheet Э3-1; Manufacturer: *; PartNumber: *; Package: *; HelpURL: *; PowerRating: *; DatasheetURL: *; Tolerance: *; ComponentType: RES
XP1 = XP_70_Pin_Open: TemperatureRange: -XX...+XX°C; Manufacturer: *; Package: *; HelpURL: *; DatasheetURL: *; PartNumber: *; PinCount: 70; ComponentType: Connector
MH1-MH4 = Mechanical Connection: ClassName: DC

## Nets that join several sheets
1.3V_TX: Э3-1 (L7.2 L8.2 L9.1 L10.1), Э3-2 (8 pins)
1.8V_VDD_INTERFACE: Э3-1 (R30.2), Э3-2 (C46.1 C51.1 DA1.H12 L15.2)
3.3V: Э3-1 (5 pins), Э3-2 (6 pins)
GND: Э3-1 (81 pins), Э3-2 (131 pins)
CLK_OUT: Э3-1 (DA1.J6), Э3-2 (XP1.58)
CTRL_IN0: Э3-1 (DA1.C5), Э3-2 (XP1.3)
CTRL_IN1: Э3-1 (DA1.C6), Э3-2 (XP1.4)
CTRL_IN2: Э3-1 (DA1.D6), Э3-2 (XP1.5)
CTRL_IN3: Э3-1 (DA1.D5), Э3-2 (XP1.6)
CTRL_OUT0: Э3-1 (DA1.D4), Э3-2 (XP1.8)
CTRL_OUT1: Э3-1 (DA1.E4), Э3-2 (XP1.9)
CTRL_OUT2: Э3-1 (DA1.E5), Э3-2 (XP1.10)
CTRL_OUT3: Э3-1 (DA1.E6), Э3-2 (XP1.11)
CTRL_OUT4: Э3-1 (DA1.F6), Э3-2 (XP1.13)
CTRL_OUT5: Э3-1 (DA1.F5), Э3-2 (XP1.14)
CTRL_OUT6: Э3-1 (DA1.F4), Э3-2 (XP1.15)
CTRL_OUT7: Э3-1 (DA1.G4), Э3-2 (XP1.16)
DATA_CLK: Э3-1 (DA1.H11), Э3-2 (XP1.54)
EN_AGC: Э3-1 (DA1.G5), Э3-2 (XP1.68)
ENABLE: Э3-1 (DA1.G6), Э3-2 (XP1.66)
FB_CLK: Э3-1 (DA1.F10), Э3-2 (XP1.34)
nRESET: Э3-1 (DA1.K5 R30.1), Э3-2 (XP1.67)
nSPI_EN: Э3-1 (DA1.K6), Э3-2 (XP1.64)
RX_D0: Э3-1 (DA1.K11), Э3-2 (XP1.39)
RX_D1: Э3-1 (DA1.J12), Э3-2 (XP1.40)
RX_D2: Э3-1 (DA1.K10), Э3-2 (XP1.41)
RX_D3: Э3-1 (DA1.J11), Э3-2 (XP1.42)
RX_D4: Э3-1 (DA1.K9), Э3-2 (XP1.44)
RX_D5: Э3-1 (DA1.J10), Э3-2 (XP1.45)
RX_D6: Э3-1 (DA1.K8), Э3-2 (XP1.46)
RX_D7: Э3-1 (DA1.J9), Э3-2 (XP1.47)
RX_D8: Э3-1 (DA1.K7), Э3-2 (XP1.49)
RX_D9: Э3-1 (DA1.J8), Э3-2 (XP1.50)
RX_D10: Э3-1 (DA1.J7), Э3-2 (XP1.51)
RX_D11: Э3-1 (DA1.H8), Э3-2 (XP1.52)
RX_FRAME: Э3-1 (DA1.G8), Э3-2 (XP1.55)
SPI_MISO: Э3-1 (DA1.L6), Э3-2 (XP1.62)
SPI_MOSI: Э3-1 (DA1.J4), Э3-2 (XP1.63)
SPI_SCLK: Э3-1 (DA1.J5), Э3-2 (XP1.59)
TX_D0: Э3-1 (DA1.E12), Э3-2 (XP1.19)
TX_D1: Э3-1 (DA1.D11), Э3-2 (XP1.20)
TX_D2: Э3-1 (DA1.E11), Э3-2 (XP1.21)
TX_D3: Э3-1 (DA1.D10), Э3-2 (XP1.22)
TX_D4: Э3-1 (DA1.E10), Э3-2 (XP1.24)
TX_D5: Э3-1 (DA1.D9), Э3-2 (XP1.25)
TX_D6: Э3-1 (DA1.E9), Э3-2 (XP1.26)
TX_D7: Э3-1 (DA1.D8), Э3-2 (XP1.27)
TX_D8: Э3-1 (DA1.E8), Э3-2 (XP1.29)
TX_D9: Э3-1 (DA1.D7), Э3-2 (XP1.30)
TX_D10: Э3-1 (DA1.F8), Э3-2 (XP1.31)
TX_D11: Э3-1 (DA1.E7), Э3-2 (XP1.32)
TX_FRAME: Э3-1 (DA1.G9), Э3-2 (XP1.35)
TXNRX: Э3-1 (DA1.H4), Э3-2 (XP1.69)